# EAGLE design nedonand1 (EAGLE 5.12)
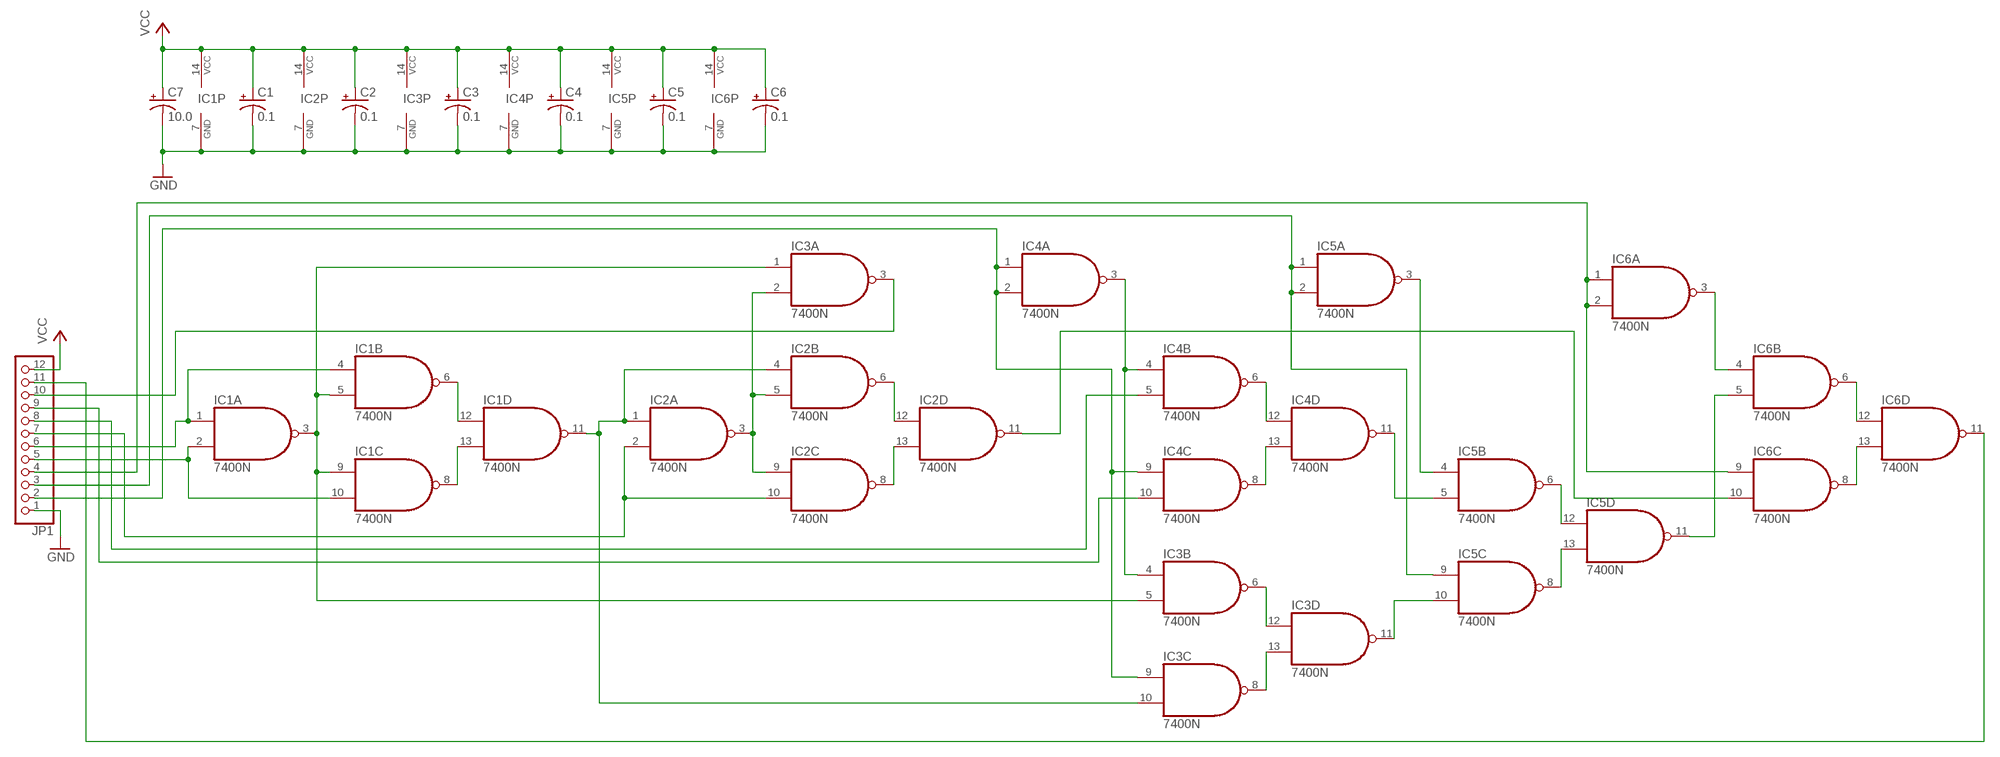
[diagram p0: schematic, sheet 1]

## Parts
C1  0.1  CPOL-USB45181A  [B45181A]
C2  0.1  CPOL-USB45181A  [B45181A]
C3  0.1  CPOL-USB45181A  [B45181A]
C4  0.1  CPOL-USB45181A  [B45181A]
C5  0.1  CPOL-USB45181A  [B45181A]
C6  0.1  CPOL-USB45181A  [B45181A]
C7  10.0  CPOL-USE2,5-6E  [E2,5-6E]
IC1  7400N  [DIL14]
IC2  7400N  [DIL14]
IC3  7400N  [DIL14]
IC4  7400N  [DIL14]
IC5  7400N  [DIL14]
IC6  7400N  [DIL14]
JP1  PINHD-1X12/90  [1X12/90]

## Nets
GND: C1.- C2.- C3.- C4.- C5.- C6.- C7.- IC1.7(P:GND) IC2.7(P:GND) IC3.7(P:GND) IC4.7(P:GND) IC5.7(P:GND) IC6.7(P:GND) JP1.1
N$1: IC1.3(A:O) IC1.5(B:I1) IC1.9(C:I0) IC3.1(A:I0) IC3.5(B:I1)
N$2: IC1.6(B:O) IC1.12(D:I0)
N$3: IC1.8(C:O) IC1.13(D:I1)
N$4: IC2.3(A:O) IC2.5(B:I1) IC2.9(C:I0) IC3.2(A:I1)
N$5: IC2.6(B:O) IC2.12(D:I0)
N$6: IC2.8(C:O) IC2.13(D:I1)
N$7: IC1.2(A:I1) IC1.10(C:I1) JP1.5
N$8: IC1.1(A:I0) IC1.4(B:I0) JP1.6
N$9: IC3.9(C:I0) IC4.1(A:I0) IC4.2(A:I1) IC4.9(C:I0) JP1.2
N$10: IC2.2(A:I1) IC2.10(C:I1) JP1.7
N$11: IC4.5(B:I1) JP1.8
N$12: IC4.10(C:I1) JP1.9
N$13: IC1.11(D:O) IC2.1(A:I0) IC2.4(B:I0) IC3.10(C:I1)
N$14: IC6.3(A:O) IC6.4(B:I0)
N$15: IC6.1(A:I0) IC6.2(A:I1) IC6.9(C:I0) JP1.4
N$16: IC3.3(A:O) JP1.10
N$17: IC3.4(B:I0) IC4.3(A:O) IC4.4(B:I0)
N$18: IC6.11(D:O) JP1.11
N$19: IC5.11(D:O) IC6.5(B:I1)
N$20: IC4.6(B:O) IC4.12(D:I0)
N$21: IC4.8(C:O) IC4.13(D:I1)
N$22: IC3.6(B:O) IC3.12(D:I0)
N$23: IC3.8(C:O) IC3.13(D:I1)
N$24: IC4.11(D:O) IC5.5(B:I1)
N$25: IC3.11(D:O) IC5.10(C:I1)
N$26: IC5.3(A:O) IC5.4(B:I0)
N$27: IC5.6(B:O) IC5.12(D:I0)
N$28: IC5.8(C:O) IC5.13(D:I1)
N$29: IC5.1(A:I0) IC5.2(A:I1) IC5.9(C:I0) JP1.3
N$30: IC2.11(D:O) IC6.10(C:I1)
N$31: IC6.6(B:O) IC6.12(D:I0)
N$32: IC6.8(C:O) IC6.13(D:I1)
VCC: C1.+ C2.+ C3.+ C4.+ C5.+ C6.+ C7.+ IC1.14(P:VCC) IC2.14(P:VCC) IC3.14(P:VCC) IC4.14(P:VCC) IC5.14(P:VCC) IC6.14(P:VCC) JP1.12

## Library data of the parts
C1-C7 = rcl:CPOL-US: POLARIZED CAPACITOR, American symbol
IC1-IC6 = 74xx-us:74*00: Quad 2-input NAND gate
JP1 = pinhead:PINHD-1X12: PIN HEADER

## Board
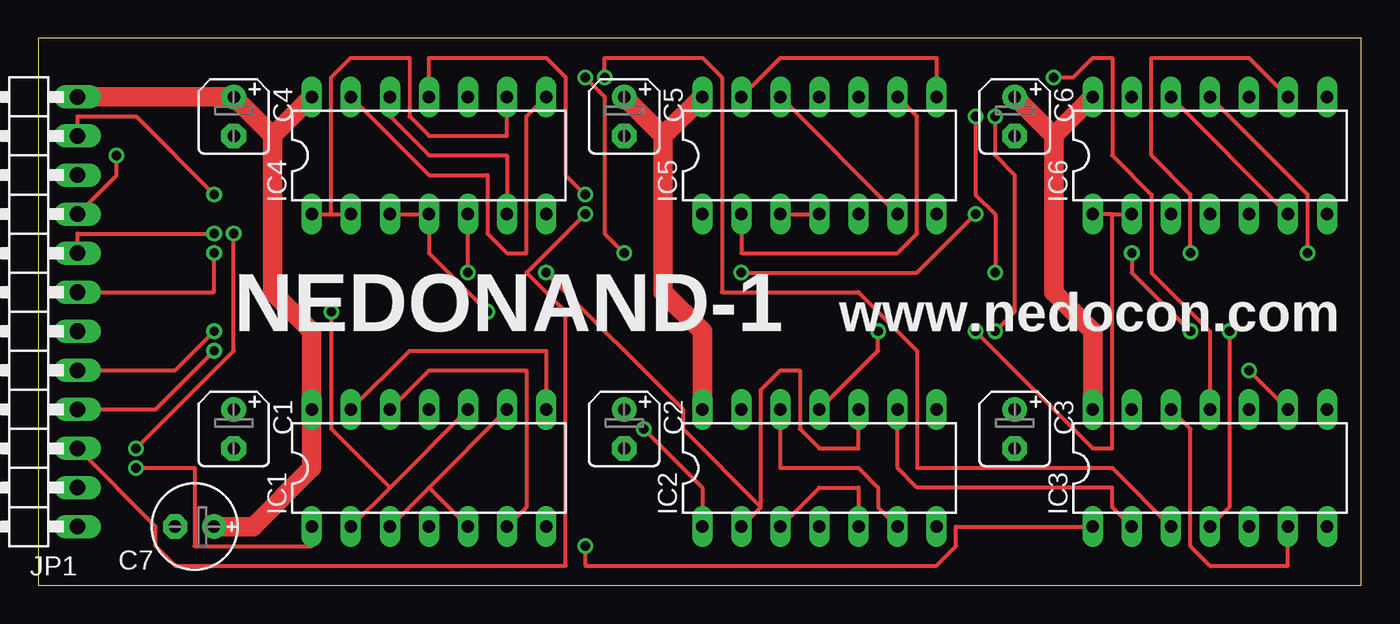
[diagram p1: board, top side]
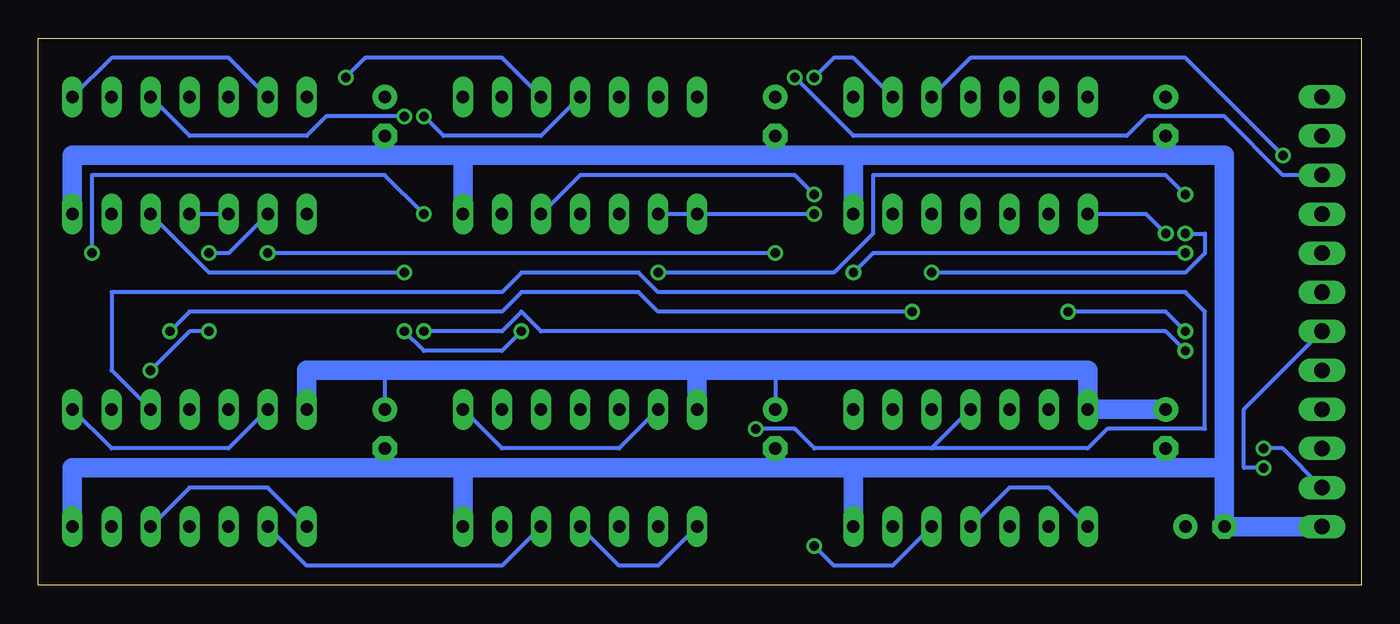
[diagram p2: board, bottom side, seen from below]

Size 86.03 x 35.55 mm. Coordinates in mm from the lower left corner, seen from the top.
Outline: 0,0 86.03,0 86.03,35.55 0,35.55 0,0
Copper layers (1*16): Top 0.035mm / dielectric 1.5mm / Bottom 0.035mm
Design rules "default": minimum track width 10mil, minimum drill 24mil, track to track 8mil, track to pad 8mil, pad to pad 8mil, via to via 8mil, smd to smd 8mil, copper to edge 40mil, drill to drill 8mil, minimum pad ring 10mil, minimum via ring 8mil, stop-mask expansion 4mil, vias tented up to drill 0mil, thermal gap 10mil

### Footprints (pad centres in the part's own frame; a part is rotated, then mirrored left to right if it is on the bottom)
B45181A = drill 0.813 pad 1.6 round: + -1.27,0 | drill 0.813 pad 1.6 octagon: - 1.27,0
E2,5-6E = drill 0.813 pad 1.575 round: + -1.27,0 | drill 0.813 pad 1.575 octagon: - 1.27,0
DIL14 = drill 0.813 long: 1 -7.62,-3.81; 2 -5.08,-3.81; 3 -2.54,-3.81; 4 0,-3.81; 5 2.54,-3.81; 6 5.08,-3.81; 7 7.62,-3.81; 8 7.62,3.81; 9 5.08,3.81; 10 2.54,3.81; 11 0,3.81; 12 -2.54,3.81; 13 -5.08,3.81; 14 -7.62,3.81
1X12/90 = drill 1.016 long: 1 -13.97,-3.81; 2 -11.43,-3.81; 3 -8.89,-3.81; 4 -6.35,-3.81; 5 -3.81,-3.81; 6 -1.27,-3.81; 7 1.27,-3.81; 8 3.81,-3.81; 9 6.35,-3.81; 10 8.89,-3.81; 11 11.43,-3.81; 12 13.97,-3.81

### Placement (x,y rotation side)
C1  12.7,10.16 270 top
C2  38.1,10.16 270 top
C3  63.5,10.16 270 top
C4  12.7,30.48 270 top
C5  38.1,30.48 270 top
C6  63.5,30.48 270 top
C7  10.16,3.81 180 top
IC1  25.4,7.62 0 top
IC2  50.8,7.62 0 top
IC3  76.2,7.62 0 top
IC4  25.4,27.94 0 top
IC5  50.8,27.94 0 top
IC6  76.2,27.94 0 top
JP1  -1.27,17.78 90 top

### Tracks (layer width: path | path; a pad name or v marks a point on that pad's centre or on a via)
GND
  Bottom 1.27: JP1.1 C7.- 8.89,7.62 | 8.89,7.62 12.7,7.62 | 12.7,7.62 33.02,7.62 | 33.02,7.62 38.1,7.62 | 38.1,7.62 58.42,7.62 | 58.42,7.62 63.5,7.62 | 63.5,7.62 83.82,7.62 IC3.7 | 63.5,7.62 C3.- | 38.1,7.62 C2.- | 12.7,7.62 C1.- | 12.7,27.94 C4.- | 12.7,27.94 33.02,27.94 | 33.02,27.94 38.1,27.94 | 38.1,27.94 58.42,27.94 | 58.42,27.94 63.5,27.94 | 63.5,27.94 83.82,27.94 IC6.7 | 33.02,7.62 IC1.7 | 58.42,7.62 IC2.7 | 58.42,27.94 IC5.7 | 33.02,27.94 IC4.7 | 38.1,27.94 C5.- | 63.5,27.94 C6.- | 8.89,7.62 8.89,27.94 12.7,27.94
N$1  (via drill 0.61)
  Top 0.254: 25.4,6.35 IC1.9 | IC1.3 25.4,6.35 | 25.4,6.35 IC1.5 | IC3.1 59.69,3.81 59.69,2.54 58.42,1.27 35.56,1.27 v35.56,2.54
  Bottom 0.254: IC3.1 71.12,6.35 76.2,6.35 IC3.5 | v35.56,2.54 34.29,1.27 30.48,1.27 IC1.5
N$2
  Top 0.254: IC1.12 25.4,13.97 31.75,13.97 31.75,5.08 IC1.6
N$3
  Top 0.254: IC1.13 24.13,15.24 33.02,15.24 IC1.8
N$4
  Top 0.254: IC2.3 50.8,6.35 53.34,6.35 IC2.5 | IC2.9 55.88,7.62 57.15,6.35 69.85,6.35 69.85,5.08 IC3.2
  Bottom 0.254: IC3.2 68.58,1.27 55.88,1.27 IC2.5
N$5
  Top 0.254: IC2.6 54.61,5.08 54.61,6.35 53.34,7.62 48.26,7.62 IC2.12
N$6
  Bottom 0.254: IC2.13 48.26,8.89 55.88,8.89 IC2.8
N$7  (via drill 0.61)
  Top 0.254: 22.86,6.35 IC1.10 | 22.86,6.35 IC1.2 | JP1.5 8.89,13.97 v11.43,16.51 | v19.05,17.78 19.05,10.16 22.86,6.35
  Bottom 0.254: v11.43,16.51 12.7,17.78 v19.05,17.78
N$8  (via drill 0.61)
  Top 0.254: v6.35,7.62 10.16,7.62 10.16,2.54 17.78,2.54 IC1.1
  Bottom 0.254: IC1.1 20.32,6.35 22.86,6.35 IC1.4 | JP1.6 7.62,11.43 7.62,7.62 v6.35,7.62
N$9  (via drill 0.61)
  Top 0.254: 19.05,24.13 IC4.2 | IC4.1 19.05,24.13 | v6.35,8.89 12.7,15.24 v12.7,22.86 | v78.74,13.97 IC3.9 | v74.93,16.51 71.12,20.32 v71.12,21.59 | v38.1,21.59 36.83,22.86 36.83,31.75 v35.56,33.02 | 19.05,24.13 19.05,33.02 20.32,34.29 24.13,34.29 24.13,30.48 25.4,29.21 30.48,29.21 IC4.9
  Bottom 0.254: JP1.2 5.08,8.89 v6.35,8.89 | v12.7,22.86 13.97,24.13 IC4.1 | v78.74,13.97 76.2,16.51 v74.93,16.51 | v38.1,21.59 v71.12,21.59 | v35.56,33.02 34.29,34.29 33.02,34.29 IC4.9
N$10  (via drill 0.61)
  Top 0.254: 46.99,5.08 IC2.2 | 46.99,5.08 46.99,12.7 48.26,13.97 49.53,13.97 49.53,10.16 50.8,8.89 53.34,8.89 IC2.10 | JP1.7 11.43,19.05 v11.43,21.59 | v33.02,20.32 41.91,11.43 41.91,10.16 46.99,5.08
  Bottom 0.254: v11.43,21.59 31.75,21.59 v33.02,20.32
N$11  (via drill 0.61)
  Top 0.254: v27.94,20.32 IC4.5 | v11.43,22.86 2.54,22.86 JP1.8
  Bottom 0.254: v27.94,20.32 11.43,20.32 10.16,21.59 10.16,22.86 v11.43,22.86
N$12  (via drill 0.61)
  Top 0.254: v5.08,27.94 5.08,26.67 JP1.9
  Bottom 0.254: IC4.10 25.4,34.29 11.43,34.29 v5.08,27.94
N$13  (via drill 0.61)
  Top 0.254: v39.37,10.16 43.18,6.35 IC2.1
  Bottom 0.254: IC2.1 45.72,1.27 48.26,1.27 IC2.4 | 27.94,8.89 IC1.11 | 27.94,8.89 35.56,8.89 36.83,10.16 v39.37,10.16 | IC3.10 81.28,13.97 81.28,19.05 55.88,19.05 54.61,20.32 46.99,20.32 45.72,19.05 11.43,19.05 10.16,17.78 10.16,10.16 16.51,10.16 17.78,8.89 27.94,8.89
N$14
  Bottom 0.254: IC6.3 IC6.4
N$15  (via drill 0.61)
  Top 0.254: 69.85,24.13 IC6.2 | 69.85,24.13 IC6.1 | IC6.9 78.74,34.29 72.39,34.29 72.39,27.94 74.93,25.4 v74.93,21.59 | JP1.4 7.62,11.43 v11.43,15.24 | v60.96,16.51 68.58,8.89 69.85,8.89 69.85,24.13
  Bottom 0.254: v74.93,21.59 73.66,21.59 IC6.2 | v11.43,15.24 12.7,16.51 53.34,16.51 54.61,17.78 55.88,16.51 v60.96,16.51
N$16  (via drill 0.61)
  Top 0.254: IC3.3 69.85,7.62 57.15,7.62 57.15,15.24 53.34,19.05 44.45,19.05 44.45,33.02 43.18,34.29 36.83,34.29 v36.83,33.02
  Bottom 0.254: v36.83,33.02 33.02,29.21 15.24,29.21 13.97,30.48 8.89,30.48 5.08,26.67 JP1.10
N$17  (via drill 0.61)
  Top 0.254: IC4.3 IC4.4 25.4,21.59 v29.21,17.78 | IC3.4 77.47,5.08 v77.47,16.51
  Bottom 0.254: v77.47,16.51 76.2,17.78 55.88,17.78 54.61,19.05 46.99,19.05 45.72,17.78 v29.21,17.78
N$18  (via drill 0.61)
  Top 0.254: IC6.11 82.55,25.4 v82.55,21.59 | v60.96,24.13 57.15,20.32 v45.72,20.32 | v11.43,25.4 6.35,30.48 2.54,30.48 JP1.11
  Bottom 0.254: v82.55,21.59 82.55,26.67 63.5,26.67 v60.96,24.13 | v45.72,20.32 34.29,20.32 31.75,22.86 31.75,26.67 12.7,26.67 v11.43,25.4
N$19  (via drill 0.61)
  Top 0.254: v60.96,30.48 60.96,25.4 62.23,24.13 v62.23,20.32
  Bottom 0.254: IC5.11 53.34,29.21 59.69,29.21 v60.96,30.48 | v62.23,20.32 74.93,20.32 IC6.5
N$20
  Top 0.254: IC4.12 22.86,30.48 25.4,27.94 30.48,27.94 IC4.6
N$21
  Top 0.254: IC4.13 25.4,26.67 29.21,26.67 29.21,22.86 30.48,21.59 31.75,21.59 31.75,30.48 IC4.8
N$22
  Top 0.254: IC3.12 74.93,10.16 74.93,2.54 76.2,1.27 81.28,1.27 IC3.6
N$23
  Bottom 0.254: IC3.13 73.66,8.89 81.28,8.89 IC3.8
N$24  (via drill 0.61)
  Top 0.254: v35.56,25.4 34.29,26.67 34.29,33.02 33.02,34.29 25.4,34.29 IC4.11
  Bottom 0.254: IC5.5 50.8,26.67 36.83,26.67 v35.56,25.4
N$25  (via drill 0.61)
  Top 0.254: v66.04,33.02 67.31,33.02 68.58,34.29 69.85,34.29 69.85,27.94 72.39,25.4 72.39,20.32 76.2,16.51 IC3.11
  Bottom 0.254: IC5.10 55.88,34.29 64.77,34.29 v66.04,33.02
N$26
  Top 0.254: IC5.3 IC5.4
N$27
  Top 0.254: IC5.12 IC5.6
N$28
  Top 0.254: IC5.13 48.26,34.29 58.42,34.29 IC5.8
N$29  (via drill 0.61)
  Top 0.254: IC5.9 57.15,30.48 57.15,22.86 55.88,21.59 45.72,21.59 IC5.2 | JP1.3 7.62,3.81 7.62,2.54 8.89,1.27 34.29,1.27 34.29,17.78 31.75,20.32 v35.56,24.13
  Bottom 0.254: IC5.2 IC5.1 v35.56,24.13
N$30  (via drill 0.61)
  Top 0.254: IC2.11 54.61,15.24 v54.61,16.51 | v62.23,16.51 63.5,17.78 63.5,26.67 62.23,27.94 v62.23,30.48
  Bottom 0.254: v54.61,16.51 55.88,15.24 60.96,15.24 v62.23,16.51 | v62.23,30.48 67.31,30.48 68.58,29.21 76.2,29.21 IC6.10
N$31
  Top 0.254: IC6.12 IC6.6
N$32
  Bottom 0.254: IC6.13 73.66,34.29 81.28,34.29 IC6.8
VCC
  Top 1.27: JP1.12 C4.+ 15.24,29.21 | C7.+ 13.97,3.81 17.78,7.62 IC1.14 17.78,16.51 15.24,19.05 15.24,29.21 | 15.24,29.21 IC4.14 | 40.64,29.21 IC5.14 | 40.64,29.21 40.64,19.05 43.18,16.51 IC2.14 | 40.64,29.21 C5.+ | 66.04,29.21 IC6.14 | 66.04,29.21 66.04,19.05 68.58,16.51 IC3.14 | 66.04,29.21 C6.+
  Bottom 0.254: 38.1,13.97 C2.+ | 63.5,13.97 C3.+
  Bottom 1.27: C1.+ IC1.14 17.78,13.97 38.1,13.97 43.18,13.97 | 43.18,13.97 63.5,13.97 68.58,13.97 IC3.14 | 43.18,13.97 IC2.14

### Text on the board
tNames: NEDONAND-1 | www.nedocon.com